# Altium schematic sheet PCB1.SchDoc
size A4
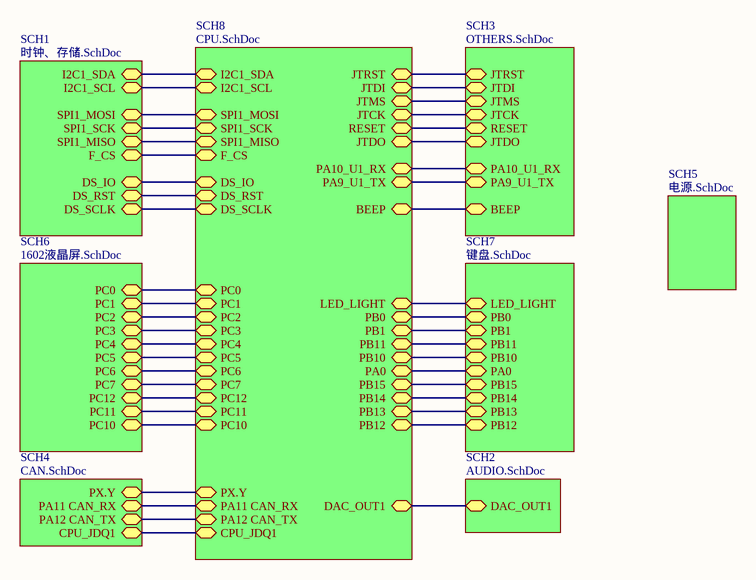
[diagram p0: PCB1.SchDoc]

## Sub-sheets
SCH1 = 时钟、存储.SchDoc: DS_SCLK, DS_RST, DS_IO, F_CS, SPI1_MISO, SPI1_SCK, SPI1_MOSI, I2C1_SCL, I2C1_SDA
SCH2 = AUDIO.SchDoc: DAC_OUT1
SCH3 = OTHERS.SchDoc: JTRST, JTDI, JTMS, JTCK, RESET, JTDO, PA10_U1_RX, PA9_U1_TX, BEEP
SCH4 = CAN.SchDoc: PX.Y, PA11 CAN_RX, PA12 CAN_TX, CPU_JDQ1
SCH5 = 电源.SchDoc: no entries
SCH6 = 1602液晶屏.SchDoc: PC10, PC11, PC12, PC7, PC6, PC5, PC4, PC3, PC2, PC1, PC0
SCH7 = 键盘.SchDoc: LED_LIGHT, PB0, PB1, PB11, PB10, PA0, PB15, PB14, PB13, PB12
SCH8 = CPU.SchDoc: DS_SCLK, DS_RST, DS_IO, F_CS, SPI1_MISO, SPI1_SCK, SPI1_MOSI, I2C1_SCL, I2C1_SDA, DAC_OUT1, JTRST, JTDI, JTMS, JTCK, RESET, JTDO, BEEP, PA10_U1_RX, PA9_U1_TX, PC10, PC11, PC12, PC7, PC6, PC5, PC4, PC3, PC2, PC1, PC0, LED_LIGHT, PB0, PB1, PB11, PB10, PA0, PB15, PB14, PB13, PB12, PA11 CAN_RX, PA12 CAN_TX, PX.Y, CPU_JDQ1

## Nets
(unnamed): sheet SCH6/PC10, sheet SCH8/PC10
(unnamed): sheet SCH6/PC11, sheet SCH8/PC11
(unnamed): sheet SCH6/PC12, sheet SCH8/PC12
(unnamed): sheet SCH6/PC7, sheet SCH8/PC7
(unnamed): sheet SCH6/PC6, sheet SCH8/PC6
(unnamed): sheet SCH6/PC5, sheet SCH8/PC5
(unnamed): sheet SCH6/PC4, sheet SCH8/PC4
(unnamed): sheet SCH6/PC3, sheet SCH8/PC3
(unnamed): sheet SCH6/PC2, sheet SCH8/PC2
(unnamed): sheet SCH6/PC1, sheet SCH8/PC1
(unnamed): sheet SCH6/PC0, sheet SCH8/PC0
(unnamed): sheet SCH2/DAC_OUT1, sheet SCH8/DAC_OUT1
(unnamed): sheet SCH4/PX.Y, sheet SCH8/PX.Y
(unnamed): sheet SCH4/PA11 CAN_RX, sheet SCH8/PA11 CAN_RX
(unnamed): sheet SCH4/PA12 CAN_TX, sheet SCH8/PA12 CAN_TX
(unnamed): sheet SCH4/CPU_JDQ1, sheet SCH8/CPU_JDQ1
(unnamed): sheet SCH8/DS_SCLK, sheet SCH1/DS_SCLK
(unnamed): sheet SCH8/DS_RST, sheet SCH1/DS_RST
(unnamed): sheet SCH8/DS_IO, sheet SCH1/DS_IO
(unnamed): sheet SCH8/F_CS, sheet SCH1/F_CS
(unnamed): sheet SCH8/SPI1_MISO, sheet SCH1/SPI1_MISO
(unnamed): sheet SCH8/SPI1_SCK, sheet SCH1/SPI1_SCK
(unnamed): sheet SCH8/SPI1_MOSI, sheet SCH1/SPI1_MOSI
(unnamed): sheet SCH8/I2C1_SCL, sheet SCH1/I2C1_SCL
(unnamed): sheet SCH8/I2C1_SDA, sheet SCH1/I2C1_SDA
(unnamed): sheet SCH8/JTRST, sheet SCH3/JTRST
(unnamed): sheet SCH8/JTDI, sheet SCH3/JTDI
(unnamed): sheet SCH8/JTMS, sheet SCH3/JTMS
(unnamed): sheet SCH8/JTCK, sheet SCH3/JTCK
(unnamed): sheet SCH8/RESET, sheet SCH3/RESET
(unnamed): sheet SCH8/JTDO, sheet SCH3/JTDO
(unnamed): sheet SCH8/BEEP, sheet SCH3/BEEP
(unnamed): sheet SCH8/PA10_U1_RX, sheet SCH3/PA10_U1_RX
(unnamed): sheet SCH8/PA9_U1_TX, sheet SCH3/PA9_U1_TX
(unnamed): sheet SCH8/LED_LIGHT, sheet SCH7/LED_LIGHT
(unnamed): sheet SCH8/PB0, sheet SCH7/PB0
(unnamed): sheet SCH8/PB1, sheet SCH7/PB1
(unnamed): sheet SCH8/PB11, sheet SCH7/PB11
(unnamed): sheet SCH8/PB10, sheet SCH7/PB10
(unnamed): sheet SCH8/PA0, sheet SCH7/PA0
(unnamed): sheet SCH8/PB15, sheet SCH7/PB15
(unnamed): sheet SCH8/PB14, sheet SCH7/PB14
(unnamed): sheet SCH8/PB13, sheet SCH7/PB13
(unnamed): sheet SCH8/PB12, sheet SCH7/PB12